# Altium schematic sheet MotorDriver.SchDoc
size A
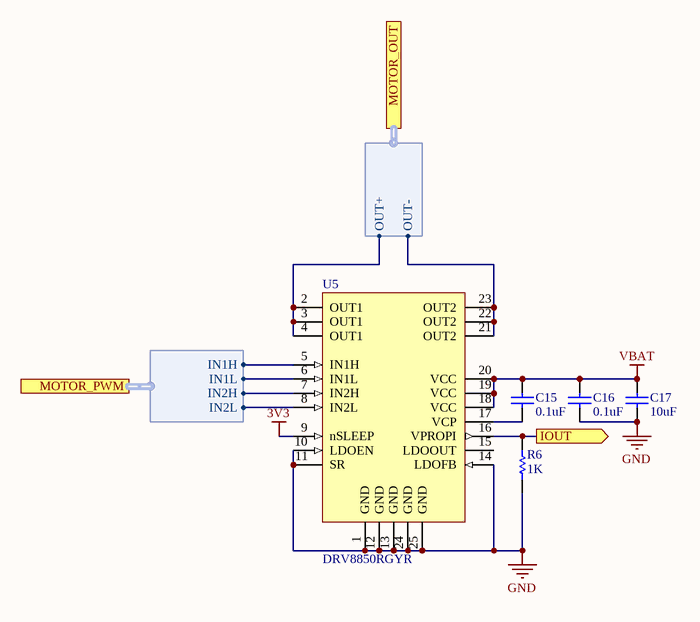
[diagram p0: MotorDriver.SchDoc]

## Parts
C15  value 0.1uF  [C0402[1005X55]]  (hidden comment: 0.1uF 100V 0402)
C16  value 0.1uF  [C0402[1005X55]]  (hidden comment: 0.1uF 6.3V 0402)
C17  value 10uF  [C0402[1005X55]]  (hidden comment: 10uF 6.3V 0402)
R6  value 1K  [R0402[1005]]  (hidden comment: 1K 1% 0402)
U5  DRV8850RGYR  [VQFN-24 (5.5X3.5MM)]

## Ports
IOUT (out), MOTOR_OUT (harness MotorOut), MOTOR_PWM (harness MotorPWM)

## Harnesses
MotorPWM: IN1H, IN1L, IN2H, IN2L
MotorOut: OUT+, OUT-

## Nets
3V3: U5.9(nSLEEP)
GND: C16.1 C17.1 R6.1 U5.1(GND) U5.10(LDOEN) U5.11(SR) U5.12(GND) U5.13(GND) U5.14(LDOFB) U5.24(GND) U5.25(GND)
VBAT: C15.1 C16.2 C17.2 U5.18(VCC) U5.19(VCC) U5.20(VCC)
IOUT: R6.2 U5.16(VPROPI) ; port IOUT
NetC15_2: C15.2 U5.17(VCP)
NetU5_2: U5.2(OUT1) U5.3(OUT1) U5.4(OUT1) ; port MOTOR_OUT.OUT+
NetU5_5: U5.5(IN1H) ; port MOTOR_PWM.IN1H
NetU5_6: U5.6(IN1L) ; port MOTOR_PWM.IN1L
NetU5_7: U5.7(IN2H) ; port MOTOR_PWM.IN2H
NetU5_8: U5.8(IN2L) ; port MOTOR_PWM.IN2L
NetU5_21: U5.21(OUT2) U5.22(OUT2) U5.23(OUT2) ; port MOTOR_OUT.OUT-

Not connected (* = marked no-connect by the designer): U5 15(LDOOUT)

## Library data of the parts
C15 = CAP_0.1uF_100V_0402_10%: 0.1uF 100V 10% 0402 (1005 Metric); PartNumber: GRM155R62A104KE14D; Manufacturer: Murata; Mounting Technology: Surface Mount; PackageReference: 0402; PackageDescription: 0402 (1005 Metric); Voltage: 100V; Tolerance: 10%
C16 = CAP_0.1uF_6.3V_0402_10%: 0.1uF 6.3V 10% 0402 (1005 Metric); PartNumber: GRM155R70J104KA01D; Manufacturer: Murata; Mounting Technology: Surface Mount; PackageReference: 0402; PackageDescription: 0402 (1005 Metric); Voltage: 6.3V; Tolerance: 10%
C17 = CAP_10uF_6.3V_0402_20%: 10uF 6.3V 20% 0402 (1005 Metric); PartNumber: GRM155R60J106ME44D; Manufacturer: Murata; Mounting Technology: Surface Mount; PackageReference: 0402; PackageDescription: 0402 (1005 Metric); Voltage: 6.3V; Tolerance: 20%
R6 = RES_1K_0402_1%: 1K 0.063W 1% 0402 (1005 Metric); Manufacturer: KOA Speer; PartNumber: RK73H1ETTP1001F; Tolerance: 1%; Power: 0.063W; Mounting Technology: Surface Mount; PackageReference: 0402; PackageDescription: 0402 (1005 Metric); ComponentLink1Description: Datasheet; ComponentLink1URL: http://www.koaspeer.com/catimages/Products/RK73H/RK73H.pdf
U5 = DRV8850RGYR: IC MOTOR DRIVER PAR 24VQFN; Manufacturer: Texas Instruments; PartNumber: DRV8850RGYR; Mounting Technology: Surface Mount; PackageReference: QFN-24